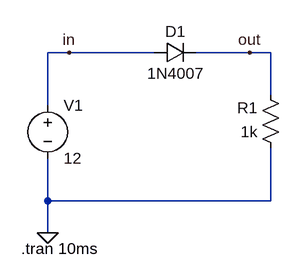
[diagram p0: schematic Power_Protecion_Circuit_2.6.asc]
Power_Protecion_Circuit_2.6.asc, the LTspice schematic file:
Version 4.1
SHEET 1 880 680
WIRE 80 48 48 48
WIRE 208 48 80 48
WIRE 352 48 272 48
WIRE 384 48 352 48
WIRE 384 112 384 48
WIRE 48 128 48 48
WIRE 48 272 48 208
WIRE 384 272 384 192
WIRE 384 272 48 272
WIRE 48 320 48 272
FLAG 48 320 0
FLAG 80 48 in
FLAG 352 48 out
SYMBOL voltage 48 112 R0
SYMATTR InstName V1
SYMATTR Value 12
SYMBOL diode 208 64 R270
WINDOW 0 32 32 VTop 2
WINDOW 3 0 32 VBottom 2
SYMATTR InstName D1
SYMATTR Value 1N4007
SYMBOL res 400 208 R180
WINDOW 0 36 76 Left 2
WINDOW 3 36 40 Left 2
SYMATTR InstName R1
SYMATTR Value 1k
TEXT 8 344 Left 2 !.tran 10ms

The netlist it stands for:
* Power_Protecion_Circuit_2.6.asc
V1 in 0 12
D1 in out 1N4007
R1 0 out 1k
.model D D
.lib standard.dio
.tran 10ms
.backanno
.end